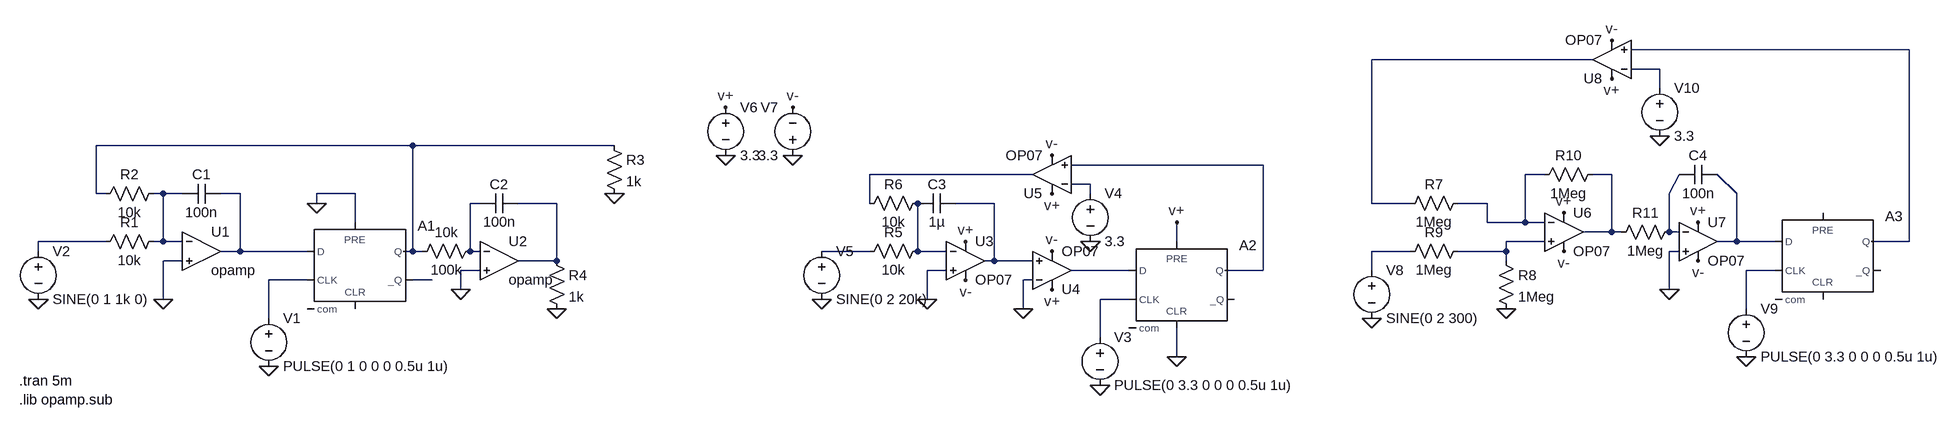
[diagram p0: schematic sigma_delta.asc]
sigma_delta.asc, the LTspice schematic file:
Version 4
SHEET 1 3092 680
WIRE 3024 -224 2560 -224
WIRE 2496 -208 2128 -208
WIRE 2608 -192 2560 -192
WIRE 2608 -160 2608 -192
WIRE 288 -64 -240 -64
WIRE 624 -64 288 -64
WIRE 1872 -32 1552 -32
WIRE 1488 -16 1216 -16
WIRE 2416 -16 2384 -16
WIRE 2528 -16 2496 -16
WIRE 1584 0 1552 0
WIRE -240 16 -240 -64
WIRE -224 16 -240 16
WIRE -128 16 -144 16
WIRE -96 16 -128 16
WIRE 0 16 -32 16
WIRE 192 16 128 16
WIRE 1584 16 1584 0
WIRE 2624 16 2640 -16
WIRE 2736 16 2704 -16
WIRE 128 32 128 16
WIRE 400 32 384 32
WIRE 528 32 464 32
WIRE 1216 32 1216 -16
WIRE 1424 32 1360 32
WIRE 2128 32 2128 -208
WIRE 2192 32 2128 32
WIRE 2320 32 2272 32
WIRE 192 64 192 16
WIRE 2320 64 2320 32
WIRE 2384 64 2384 -16
WIRE 2384 64 2320 64
WIRE 2416 64 2384 64
WIRE 2528 80 2528 -16
WIRE 2528 80 2480 80
WIRE 2544 80 2528 80
WIRE 2624 80 2624 16
WIRE 2640 80 2624 80
WIRE -224 96 -336 96
WIRE -128 96 -128 16
WIRE -128 96 -144 96
WIRE -96 96 -128 96
WIRE 1728 96 1728 64
WIRE 2416 96 2352 96
WIRE 2736 96 2736 16
WIRE 2736 96 2704 96
WIRE 2800 96 2736 96
WIRE 3024 96 3024 -224
WIRE 3024 96 2960 96
WIRE -336 112 -336 96
WIRE 0 112 0 16
WIRE 0 112 -32 112
WIRE 112 112 0 112
WIRE 288 112 288 -64
WIRE 288 112 272 112
WIRE 304 112 288 112
WIRE 384 112 384 32
WIRE 400 112 384 112
WIRE 1216 112 1136 112
WIRE 1296 112 1296 32
WIRE 1344 112 1296 112
WIRE 2192 112 2128 112
WIRE 2352 112 2352 96
WIRE 2352 112 2272 112
WIRE 2640 112 2624 112
WIRE -96 128 -128 128
WIRE 528 128 528 32
WIRE 528 128 464 128
WIRE 1424 128 1424 32
WIRE 1424 128 1408 128
WIRE 1488 128 1424 128
WIRE 2352 128 2352 112
WIRE 400 144 368 144
WIRE 1344 144 1312 144
WIRE 1648 144 1552 144
WIRE 1872 144 1872 -32
WIRE 1872 144 1808 144
WIRE 2128 144 2128 112
WIRE 2800 144 2752 144
WIRE 112 160 48 160
WIRE 320 160 288 160
WIRE 1488 160 1472 160
WIRE 368 176 368 144
WIRE 2624 176 2624 112
WIRE -128 192 -128 128
WIRE 1312 192 1312 144
WIRE 1648 192 1600 192
WIRE 1472 208 1472 160
WIRE 2752 208 2752 144
WIRE 48 224 48 160
WIRE 1600 256 1600 192
WIRE 1728 288 1728 240
FLAG -128 192 0
FLAG 368 176 0
FLAG 48 304 0
FLAG -336 192 0
FLAG 128 32 0
FLAG 624 16 0
FLAG 528 208 0
FLAG 1600 336 0
FLAG 1472 208 0
FLAG 1312 192 0
FLAG 1584 96 0
FLAG 1136 192 0
FLAG 1088 -48 0
FLAG 976 -48 0
FLAG 976 -128 v+
FLAG 1088 -128 v-
FLAG 1520 -48 v-
FLAG 1520 112 v-
FLAG 1376 160 v-
FLAG 1376 96 v+
FLAG 1520 176 v+
FLAG 1520 16 v+
FLAG 2352 208 0
FLAG 2448 112 v-
FLAG 2448 48 v+
FLAG 2624 176 0
FLAG 2128 224 0
FLAG 2672 128 v-
FLAG 2672 64 v+
FLAG 2752 288 0
FLAG 2528 -176 v+
FLAG 2528 -240 v-
FLAG 2608 -80 0
FLAG 1728 288 0
FLAG 1728 64 v+
SYMBOL res -128 80 R90
WINDOW 0 0 56 VBottom 2
WINDOW 3 32 56 VTop 2
SYMATTR InstName R1
SYMATTR Value 10k
SYMBOL res -128 0 R90
WINDOW 0 0 56 VBottom 2
WINDOW 3 32 56 VTop 2
SYMATTR InstName R2
SYMATTR Value 10k
SYMBOL cap -32 0 R90
WINDOW 0 0 32 VBottom 2
WINDOW 3 32 32 VTop 2
SYMATTR InstName C1
SYMATTR Value 100n
SYMBOL res 400 96 R90
WINDOW 0 0 56 VBottom 2
WINDOW 3 32 56 VTop 2
SYMATTR InstName 10k
SYMATTR Value 100k
SYMBOL cap 464 16 R90
WINDOW 0 0 32 VBottom 2
WINDOW 3 32 32 VTop 2
SYMATTR InstName C2
SYMATTR Value 100n
SYMBOL voltage -336 96 R0
WINDOW 123 0 0 Left 0
WINDOW 39 0 0 Left 0
SYMATTR InstName V2
SYMATTR Value SINE(0 1 1k 0)
SYMBOL voltage 48 208 R0
WINDOW 123 0 0 Left 0
WINDOW 39 0 0 Left 0
SYMATTR InstName V1
SYMATTR Value PULSE(0 1 0 0 0 0.5u 1u)
SYMBOL Digital\\dflop 192 64 R0
SYMATTR InstName A1
SYMBOL OpAmps\\opamp -64 48 R0
SYMATTR InstName U1
SYMBOL OpAmps\\opamp 432 64 R0
SYMATTR InstName U2
SYMBOL res 608 -80 R0
SYMATTR InstName R3
SYMATTR Value 1k
SYMBOL res 512 112 R0
SYMATTR InstName R4
SYMATTR Value 1k
SYMBOL Digital\\dflop 1728 96 R0
SYMATTR InstName A2
SYMBOL voltage 1600 240 R0
WINDOW 123 0 0 Left 0
WINDOW 39 0 0 Left 0
SYMATTR InstName V3
SYMATTR Value PULSE(0 3.3 0 0 0 0.5u 1u)
SYMBOL res 1312 96 R90
WINDOW 0 0 56 VBottom 2
WINDOW 3 32 56 VTop 2
SYMATTR InstName R5
SYMATTR Value 10k
SYMBOL res 1312 16 R90
WINDOW 0 0 56 VBottom 2
WINDOW 3 32 56 VTop 2
SYMATTR InstName R6
SYMATTR Value 10k
SYMBOL cap 1360 16 R90
WINDOW 0 0 32 VBottom 2
WINDOW 3 32 32 VTop 2
SYMATTR InstName C3
SYMATTR Value 1µ
SYMBOL voltage 1584 0 R0
WINDOW 123 0 0 Left 0
WINDOW 39 0 0 Left 0
SYMATTR InstName V4
SYMATTR Value 3.3
SYMBOL voltage 1136 96 R0
WINDOW 123 0 0 Left 0
WINDOW 39 0 0 Left 0
SYMATTR InstName V5
SYMATTR Value SINE(0 2 20k)
SYMBOL OpAmps\\OP07 1376 64 R0
SYMATTR InstName U3
SYMBOL OpAmps\\OP07 1520 48 R180
SYMATTR InstName U5
SYMBOL OpAmps\\OP07 1520 208 M180
SYMATTR InstName U4
SYMBOL voltage 976 -144 R0
WINDOW 123 0 0 Left 0
WINDOW 39 0 0 Left 0
SYMATTR InstName V6
SYMATTR Value 3.3
SYMBOL voltage 1088 -32 R180
WINDOW 0 24 96 Left 2
WINDOW 3 24 16 Left 2
WINDOW 123 0 0 Left 0
WINDOW 39 0 0 Left 0
SYMATTR InstName V7
SYMATTR Value 3.3
SYMBOL res 2288 16 R90
WINDOW 0 0 56 VBottom 2
WINDOW 3 32 56 VTop 2
SYMATTR InstName R7
SYMATTR Value 1Meg
SYMBOL res 2288 96 R90
WINDOW 0 0 56 VBottom 2
WINDOW 3 32 56 VTop 2
SYMATTR InstName R9
SYMATTR Value 1Meg
SYMBOL OpAmps\\OP07 2448 16 R0
SYMATTR InstName U6
SYMBOL res 2336 112 R0
SYMATTR InstName R8
SYMATTR Value 1Meg
SYMBOL res 2512 -32 R90
WINDOW 0 0 56 VBottom 2
WINDOW 3 32 56 VTop 2
SYMATTR InstName R10
SYMATTR Value 1Meg
SYMBOL OpAmps\\OP07 2672 32 R0
SYMATTR InstName U7
SYMBOL cap 2704 -32 R90
WINDOW 0 0 32 VBottom 2
WINDOW 3 32 32 VTop 2
SYMATTR InstName C4
SYMATTR Value 100n
SYMBOL res 2640 64 R90
WINDOW 0 0 56 VBottom 2
WINDOW 3 32 56 VTop 2
SYMATTR InstName R11
SYMATTR Value 1Meg
SYMBOL voltage 2128 128 R0
WINDOW 123 0 0 Left 0
WINDOW 39 0 0 Left 0
SYMATTR InstName V8
SYMATTR Value SINE(0 2 300)
SYMBOL Digital\\dflop 2880 48 R0
SYMATTR InstName A3
SYMBOL voltage 2752 192 R0
WINDOW 123 0 0 Left 0
WINDOW 39 0 0 Left 0
SYMATTR InstName V9
SYMATTR Value PULSE(0 3.3 0 0 0 0.5u 1u)
SYMBOL OpAmps\\OP07 2528 -144 R180
SYMATTR InstName U8
SYMBOL voltage 2608 -176 R0
WINDOW 123 0 0 Left 0
WINDOW 39 0 0 Left 0
SYMATTR InstName V10
SYMATTR Value 3.3
TEXT -368 328 Left 2 !.tran 5m
TEXT -368 360 Left 2 !.lib opamp.sub

The netlist it stands for:
* sigma_delta.asc
R1 N010 N017 10k
R2 N010 N004 10k
C1 N011 N010 100n
R§10k N014 N004 100k
C2 N015 N014 100n
V2 N017 0 SINE(0 1 1k 0)
V1 N024 0 PULSE(0 1 0 0 0 0.5u 1u)
A1 N011 0 N024 0 0 N025 N004 0 DFLOP
XU1 N010 0 N011 opamp Aol=100K GBW=10Meg  ; pins invin noninvin out
XU2 N014 0 N015 opamp Aol=100K GBW=10Meg  ; pins invin noninvin out
R3 N004 0 1k
R4 N015 0 1k
A2 N022 0 N026 v+ 0 0 N005 0 DFLOP
V3 N026 0 PULSE(0 3.3 0 0 0 0.5u 1u)
R5 N020 N019 10k
R6 N020 N006 10k
C3 N016 N020 1µ
V4 N009 0 3.3
V5 N019 0 SINE(0 2 20k)
XU3 0 N020 v+ v- N016 LT1001  ; OP07, pins In+ In- V+ V- OUT
XU5 N005 N009 v+ v- N006 LT1001  ; OP07, pins In+ In- V+ V- OUT
XU4 N016 0 v+ v- N022 LT1001  ; OP07, pins In+ In- V+ V- OUT
V6 v+ 0 3.3
V7 0 v- 3.3
R7 N007 N002 1Meg
R9 N018 N021 1Meg
XU6 N018 N007 v+ v- N008 LT1001  ; OP07, pins In+ In- V+ V- OUT
R8 N018 0 1Meg
R10 N008 N007 1Meg
XU7 0 N012 v+ v- N013 LT1001  ; OP07, pins In+ In- V+ V- OUT
C4 N013 N012 100n
R11 N012 N008 1Meg
V8 N021 0 SINE(0 2 300)
A3 N013 0 N023 0 0 0 N001 0 DFLOP
V9 N023 0 PULSE(0 3.3 0 0 0 0.5u 1u)
XU8 N001 N003 v+ v- N002 LT1001  ; OP07, pins In+ In- V+ V- OUT
V10 N003 0 3.3
.tran 5m
.lib opamp.sub
.lib LTC.lib
.backanno
.end